# Altium schematic sheet Mechanical.SchDoc: Mechanical
size A4; Date: Not used; ApprovedBy: Not used; CheckedBy: Not used; Author: Not used; CompanyName: STMicroelectronics; DrawnBy: Not used; Engineer: Not used; Organization: Not used; Address1: Not used; Address2: Not used; Address3: Not used; Address4: Not used; DocumentNumber: Not used; Revision: Not used; SheetNumber: 6; SheetTotal: 6; CurrentTime: Not used; CurrentDate: Not used; Time: Not used; DocumentFullPathAndName: Not used; DocumentName: Not used; ModifiedDate: Not used; ImagePath: Not used; ProjectName: Not used; Application_BuildNumber: Not used
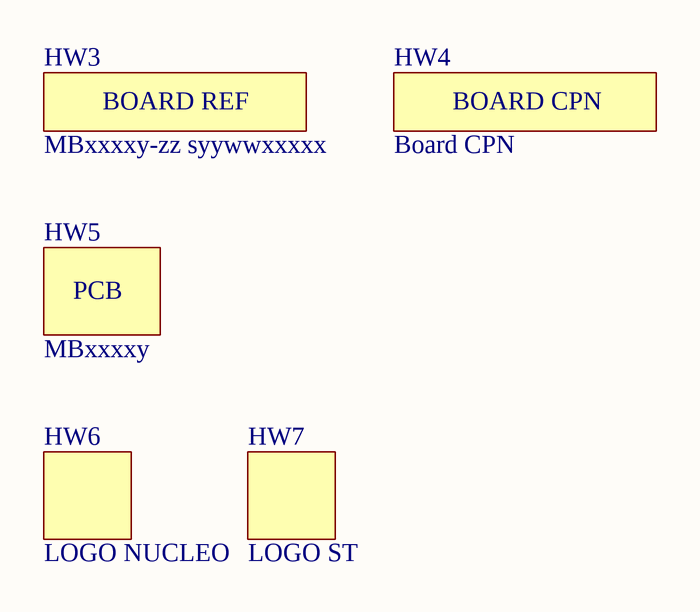
[diagram p0: Mechanical.SchDoc]

## Parts
HW3  value MBxxxxy-zz syywwxxxxx  [STICKER_25X9]  (hidden comment: STICKER_BOARD_REF)  (mechanical)
HW4  value Board CPN  [STICKER_25X9]  (hidden comment: STICKER_BOARD_CPN)  (mechanical)
HW5  value MBxxxxy  (hidden comment: PCB)  (mechanical)
HW6  value LOGO NUCLEO  [LOGO_NUCLEO]  (hidden comment: Logo)  (no BOM)
HW7  value LOGO ST  [LOGO_ST]  (hidden comment: Logo)  (no BOM)

## Notes on the sheet
- Title:
- Project:
- Size:
- Revision:
- Variant:
- A4
- -
- Date:
- Reference:
- Sheet:
- of
- (in symbol MCD-00235) BOARD REF
- (in symbol MCD-00547) BOARD CPN

## Library data of the parts
HW3 = MCD-00235: Sticker to mention board reference + serial number; Part_Type: Mechanical; Provided_By: SUBCO; Internal_Part_Number: MCD-00235; Status: Released; Manufacturer_Part_Number: n/a; Manufacturer: n/a; ComponentLink1Description: Datasheet; ComponentLink1URL: n/a; ECCN_US: n/a; ECCN_EU: n/a
HW4 = MCD-00547: Sticker to mention board CPN code; Part_Type: Mechanical; Provided_By: SUBCO; Internal_Part_Number: MCD-00547; Status: Released; Manufacturer_Part_Number: n/a; Manufacturer: n/a; ComponentLink1Description: Datasheet; ComponentLink1URL: NA; ECCN_US: n/a; ECCN_EU: n/a
HW5 = MCD-00216: PCB, xxxx for PCB number, Y for PCB revision; Part_Type: Mechanical; Provided_By: SUBCO; Internal_Part_Number: MCD-00216; Status: Released; ComponentLink1Description: Datasheet; Manufacturer_Part_Number: n/a; Manufacturer: n/a; ECCN_US: n/a; ECCN_EU: n/a
HW6 = MCD-00636: NUCLEO logo footprint for PCB; Part_Type: Mechanical; Internal_Part_Number: MCD-00636; Status: Released; Provided_By: n/a; ComponentLink1Description: Datasheet; ECCN_US: n/a; ECCN_EU: n/a
HW7 = MCD-00625: STMicroelectronics logo footprint for PCB; Part_Type: Mechanical; Internal_Part_Number: MCD-00625; Status: Released; Provided_By: n/a; Manufacturer_Part_Number: n/a; Manufacturer: n/a; ComponentLink1Description: Datasheet; ComponentLink1URL: http://na; ECCN_US: n/a; ECCN_EU: n/a